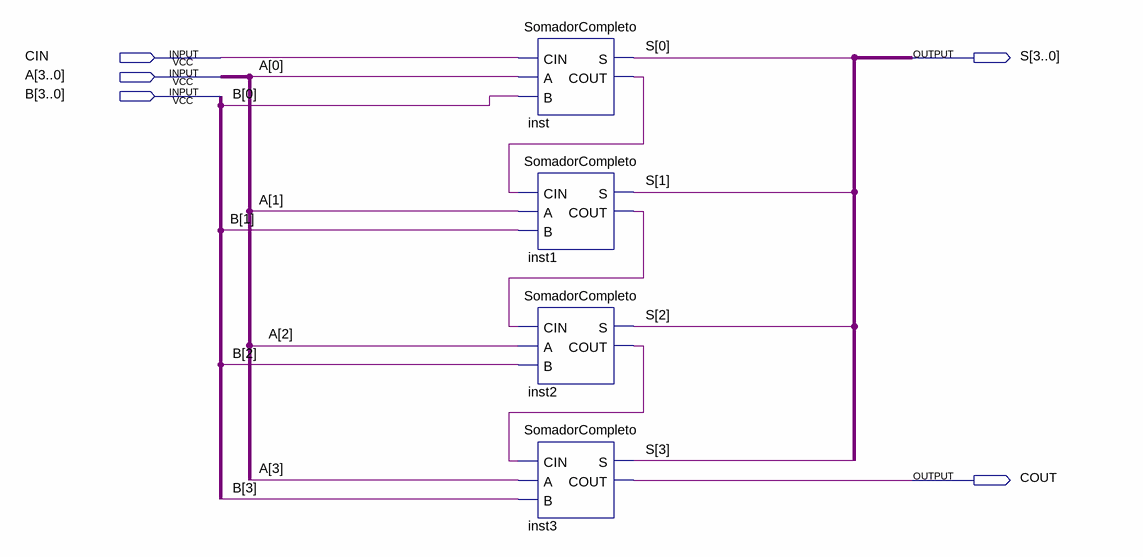
[diagram p0: schematic sheet]
// Quartus schematic Somador4bits.bdf as structural Verilog: 4 symbols, 5 pins
module Somador4bits (
  input  CIN,
  input  [3:0] A,
  input  [3:0] B,
  output [3:0] S,
  output COUT
);

  wire inst1_cout, inst2_cout, inst_cout;

  SomadorCompleto inst (.CIN(CIN), .A(A[0]), .B(B[0]), .S(S[0]), .COUT(inst_cout));
  SomadorCompleto inst1 (.CIN(inst_cout), .A(A[1]), .B(B[1]), .S(S[1]), .COUT(inst1_cout));
  SomadorCompleto inst2 (.CIN(inst1_cout), .A(A[2]), .B(B[2]), .S(S[2]), .COUT(inst2_cout));
  SomadorCompleto inst3 (.CIN(inst2_cout), .A(A[3]), .B(B[3]), .S(S[3]), .COUT(COUT));
endmodule
